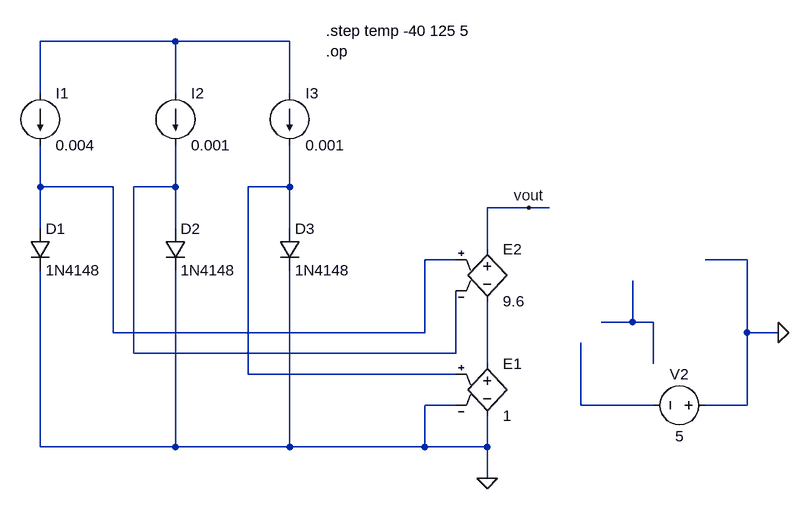
[diagram p0: schematic Draft12.asc]
Draft12.asc, the LTspice schematic file:
Version 4
SHEET 1 1584 704
WIRE 640 -32 432 -32
WIRE 816 -32 640 -32
WIRE 432 48 432 -32
WIRE 640 48 640 -32
WIRE 816 48 816 -32
WIRE 432 192 432 128
WIRE 544 192 432 192
WIRE 640 192 640 128
WIRE 640 192 576 192
WIRE 816 192 816 128
WIRE 816 192 752 192
WIRE 1184 224 1120 224
WIRE 1216 224 1184 224
WIRE 432 256 432 192
WIRE 640 256 640 192
WIRE 816 256 816 192
WIRE 1120 288 1120 224
WIRE 1072 304 1024 304
WIRE 1520 304 1456 304
WIRE 1344 400 1344 336
WIRE 1344 400 1296 400
WIRE 1376 400 1344 400
WIRE 544 416 544 192
WIRE 1024 416 1024 304
WIRE 1024 416 544 416
WIRE 1520 416 1520 304
WIRE 1568 416 1520 416
WIRE 576 448 576 192
WIRE 1072 448 1072 352
WIRE 1072 448 576 448
WIRE 1120 464 1120 368
WIRE 1376 464 1376 400
WIRE 752 480 752 192
WIRE 1072 480 752 480
WIRE 1072 528 1024 528
WIRE 1264 528 1264 432
WIRE 1376 528 1264 528
WIRE 1520 528 1520 416
WIRE 1520 528 1456 528
WIRE 432 592 432 320
WIRE 640 592 640 320
WIRE 640 592 432 592
WIRE 816 592 816 320
WIRE 816 592 640 592
WIRE 1024 592 1024 528
WIRE 1024 592 816 592
WIRE 1120 592 1120 544
WIRE 1120 592 1024 592
WIRE 1120 640 1120 592
FLAG 1120 640 0
FLAG 1184 224 vout
FLAG 1568 416 0
SYMBOL diode 416 256 R0
SYMATTR InstName D1
SYMATTR Value 1N4148
SYMBOL diode 624 256 R0
SYMATTR InstName D2
SYMATTR Value 1N4148
SYMBOL diode 800 256 R0
SYMATTR InstName D3
SYMATTR Value 1N4148
SYMBOL e 1120 272 R0
SYMATTR InstName E2
SYMATTR Value 9.6
SYMBOL e 1120 448 R0
SYMATTR InstName E1
SYMATTR Value 1
SYMBOL current 432 48 R0
SYMATTR InstName I1
SYMATTR Value 0.004
SYMBOL current 640 48 R0
SYMATTR InstName I2
SYMATTR Value 0.001
SYMBOL current 816 48 R0
SYMATTR InstName I3
SYMATTR Value 0.001
SYMBOL voltage 1472 528 R90
WINDOW 0 -32 56 VBottom 2
WINDOW 3 32 56 VTop 2
SYMATTR InstName V2
SYMATTR Value 5
TEXT 872 -48 Left 2 !.step temp -40 125 5\n.op

The netlist it stands for:
* Draft12.asc
D1 N002 0 1N4148
D2 N003 0 1N4148
D3 N004 0 1N4148
E2 vout N006 N002 N003 9.6
E1 N006 0 N004 0 1
I1 N001 N002 0.004
I2 N001 N003 0.001
I3 N001 N004 0.001
V2 0 N007 5
.model D D
.lib standard.dio
.step temp -40 125 5
.op
.backanno
.end